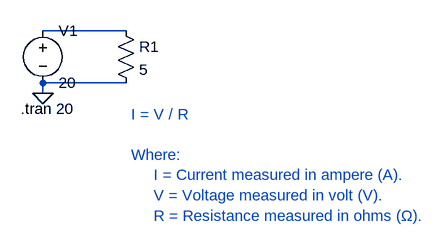
[diagram p0: schematic Circuit.asc]
Circuit.asc, the LTspice schematic file:
Version 4
SHEET 1 880 680
WIRE 48 16 -80 16
WIRE 48 96 -80 96
WIRE -80 112 -80 96
FLAG -80 112 0
SYMBOL voltage -80 0 R0
WINDOW 123 0 0 Left 0
WINDOW 39 0 0 Left 0
SYMATTR InstName V1
SYMATTR Value 20
SYMBOL res 32 0 R0
SYMATTR InstName R1
SYMATTR Value 5
TEXT -114 136 Left 2 !.tran 20
TEXT 56 144 Left 2 ;I = V / R\n \nWhere:\n     I = Current measured in ampere (A).\n     V = Voltage measured in volt (V).\n     R = Resistance measured in ohms (Ω).

The netlist it stands for:
* Circuit.asc
V1 N001 0 20
R1 N001 0 5
.tran 20
* I = V / R
* Where:
*      I = Current measured in ampere (A).
*      V = Voltage measured in volt (V).
*      R = Resistance measured in ohms (Ω).
.backanno
.end